# EAGLE design AIRDCL (EAGLE 9.5.1)
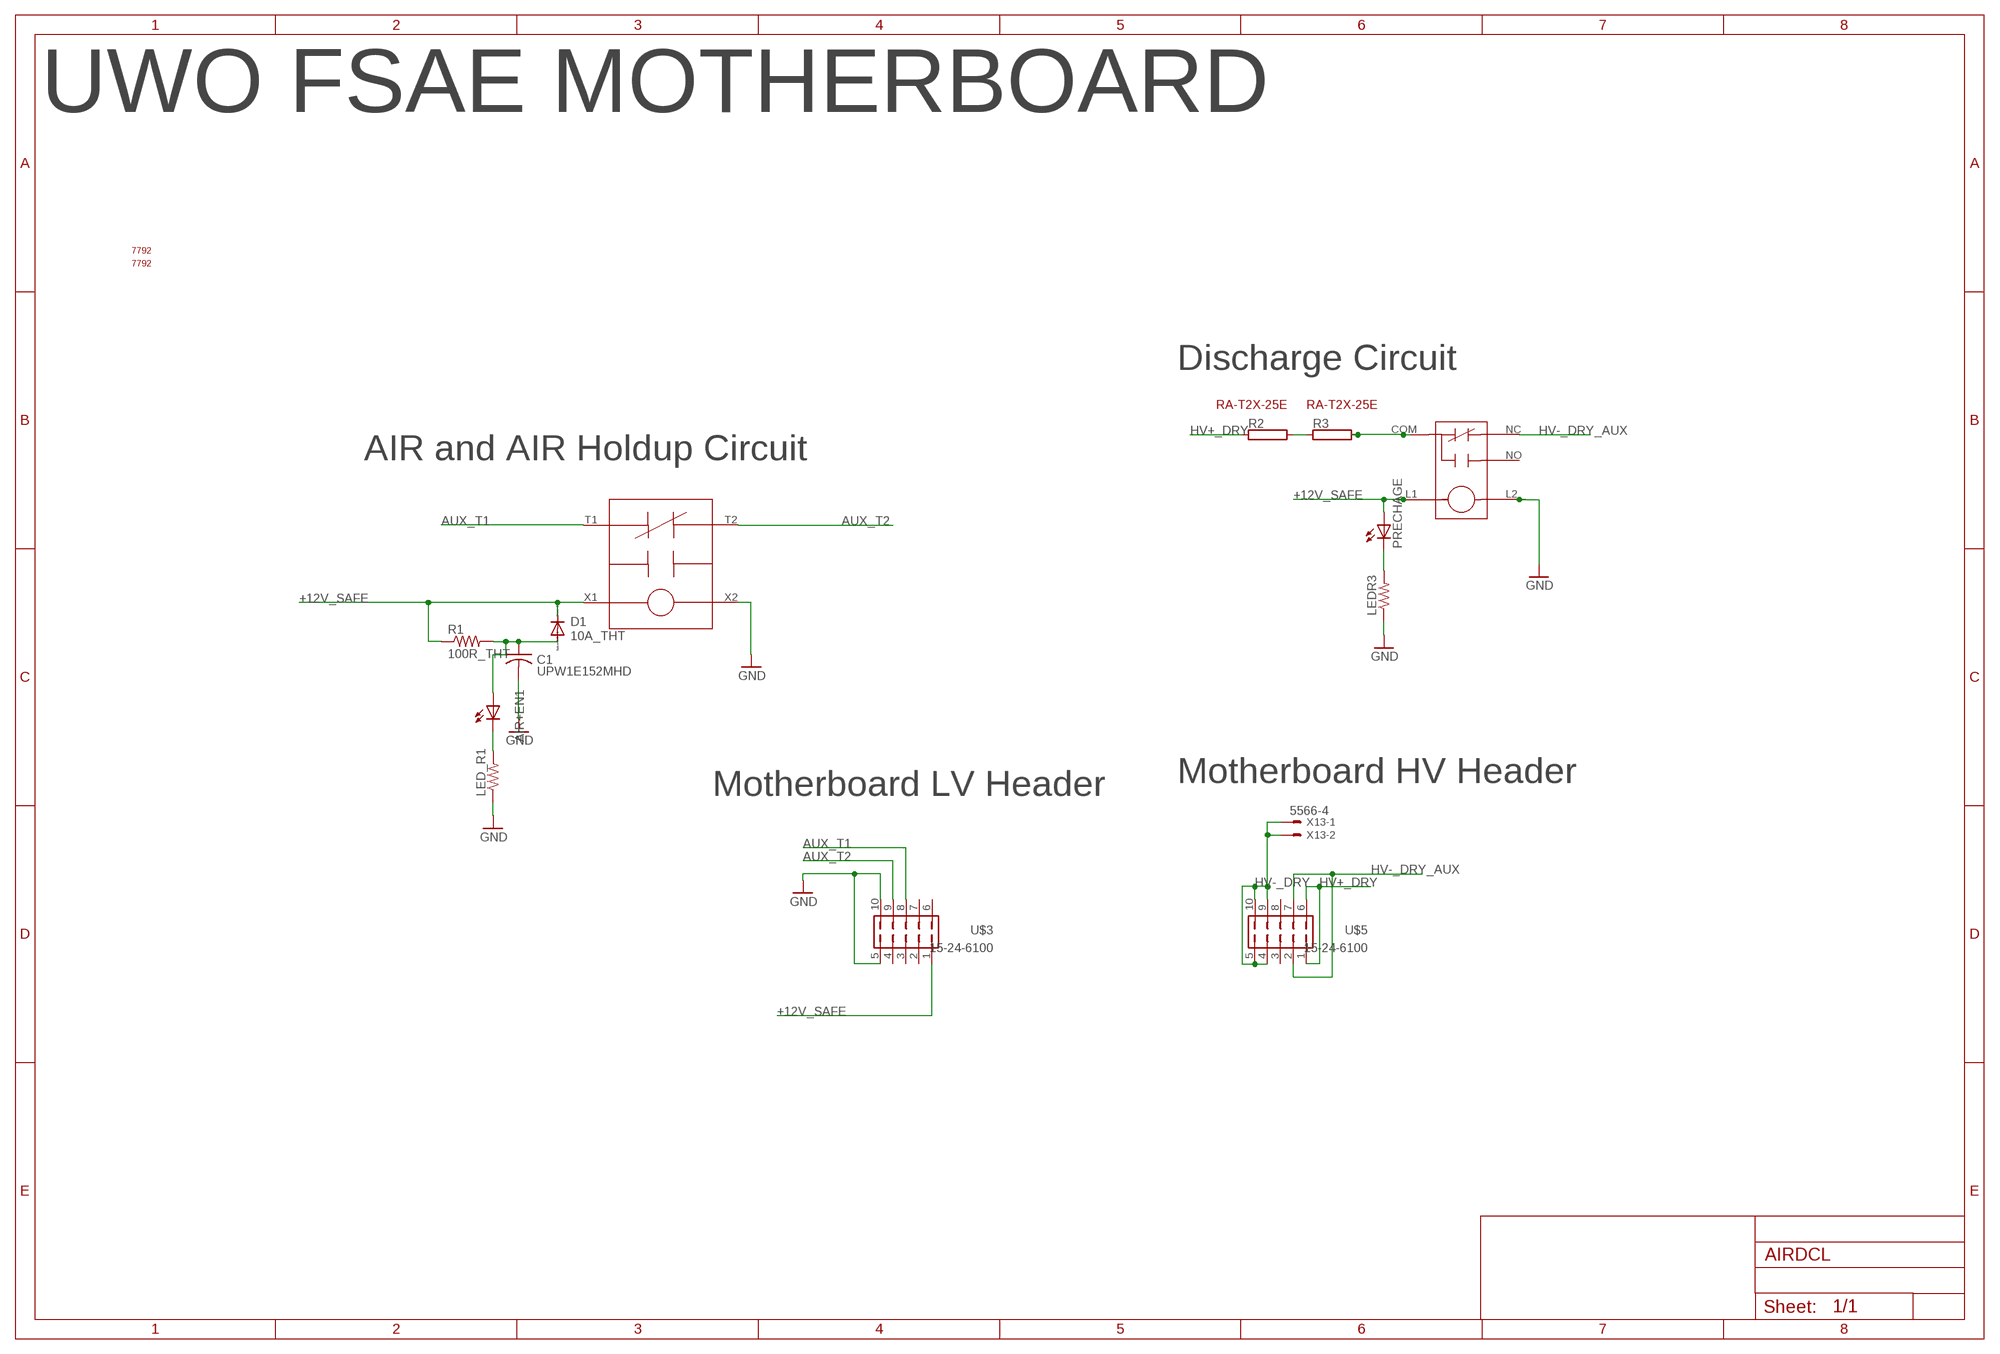
[diagram p0: schematic, sheet 1]

## Parts
AIR+EN1  LEDCHIPLED_0805  [CHIPLED_0805]
C1  UPW1E152MHD  AIR_HOLDUP_CAP  [CAPPRD750W65D1800H3700B]
D1  10A_THT  AIR_HOLDUP_DIODE  [DIOAD1570W120L850D500B]
LED_R1  R-US_R0805  [R0805]
LEDR3  R-US_R0805  [R0805]
PRECHAGE  LEDCHIPLED_0805  [CHIPLED_0805]
R1  100R_THT  AIR_HOLDUP_RESISTOR  [RESAD976W63L650D250B]
R2  RMG100-V  [TO-247-2V]
R3  RMG100-V  [TO-247-2V]
U$1  GV245BPB  GV224  [GV224]
U$2  7792  [7792]
U$3  15-24-6100  [15-24-6100]
U$4  G81C335  [G81C335]
U$5  15-24-6100  [15-24-6100]
U$6  7792  [7792]
U$8  RA-T2X-25E  [RA-T2X-25E]
U$9  RA-T2X-25E  [RA-T2X-25E]
X13  5566-4  [5566-4]

## Nets
+12V_SAFE: D1.1(C) PRECHAGE.A R1.1 U$1.X1 U$3.1 U$4.L1
AUX_T1: U$1.T1 U$3.8
AUX_T2: U$1.T2 U$3.9
GND: C1.2 LED_R1.1 LEDR3.1 U$1.X2 U$3.5 U$3.10 U$4.L2
HV+_DRY [HV]: R2.1 U$5.1 U$5.6
HV-_DRY [HV]: U$5.4 U$5.5 U$5.9 U$5.10 X13.1 X13.2
HV-_DRY_AUX [HV]: U$4.NC U$5.2 U$5.7
N$1: AIR+EN1.C LED_R1.2
N$2: LEDR3.2 PRECHAGE.C
N$3: AIR+EN1.A C1.1 D1.2(A) R1.2
N$4: R2.2 R3.1
N$21 [HV]: R3.2 U$4.COM
Unconnected: U$3.2 U$3.3 U$3.4 U$3.6 U$3.7 U$4.NO U$5.3 U$5.8 X13.3 X13.4

## Notes on the sheet
- UWO FSAE MOTHERBOARD
- Discharge Circuit
- AIR and AIR Holdup Circuit
- Motherboard HV Header
- Motherboard LV Header

## Library data of the parts
AIR+EN1 PRECHAGE = ACC-MB-R0:LED: LED OSRAM: - CHIPLED LG R971, LG N971, LY N971, LG Q971, LY Q971, LO R971, LY R971 LH N974, LH R974 LS Q976, LO Q976, LY Q976 LO Q996 - Hyper CHIPLED LW Q18S LB Q993, LB Q99A, LB R99A - SideLED LS A670, LO A670, LY A670, LG A670, LP A670 LB A673, LV A673, LT A673, LW A673 LH A674 LY A675 LS A676, LA A676, LO A676, LY A676, LW A676 LS A679, LY A679, LG A679 - Hyper Micro SIDELED® LS Y876, LA Y876, LO Y876, LY Y876 LT Y87S - SmartLED LW L88C, LW L88S LB L89C, LB L89S, LG L890 LS L89K, LO L89K, LY L89K LS L896, LA L896, LO L896, LY L896 - TOPLED LS T670, LO T670, LY T670, LG T670, LP T670 LSG T670, LSP T670, LSY T670, LOP T670, LYG T670 LG T671, LOG T671, LSG T671 LB T673, LV T673, LT T673, LW T673 LH T674 LS T676, LA T676, LO T676, LY T676, LB T676, LH T676, LSB T676, LW T676 LB T67C, LV T67C, LT T67C, LS T67K, LO T67K, LY T67K, LW E67C LS E67B, LA E67B, LO E67B, LY E67B, LB E67C, LV E67C, LT E67C LW T67C LS T679, LY T679, LG T679 LS T770, LO T770, LY T770, LG T770, LP T770 LB T773, LV T773, LT T773, LW T773 LH T774 LS E675, LA E675, LY E675, LS T675 LS T776, LA T776, LO T776, LY T776, LB T776 LHGB T686 LT T68C, LB T68C - Hyper Mini TOPLED® LB M676 - Mini TOPLED Santana® LG M470 LS M47K, LO M47K, LY M47K Source: http://www.osram.convergy.de LUXEON: - LUMILED® LXK2-PW12-R00, LXK2-PW12-S00, LXK2-PW14-U00, LXK2-PW14-V00 LXK2-PM12-R00, LXK2-PM12-S00, LXK2-PM14-U00 LXK2-PE12-Q00, LXK2-PE12-R00, LXK2-PE12-S00, LXK2-PE14-T00, LXK2-PE14-U00 LXK2-PB12-K00, LXK2-PB12-L00, LXK2-PB12-M00, LXK2-PB14-N00, LXK2-PB14-P00, LXK2-PB14-Q00 LXK2-PR12-L00, LXK2-PR12-M00, LXK2-PR14-Q00, LXK2-PR14-R00 LXK2-PD12-Q00, LXK2-PD12-R00, LXK2-PD12-S00 LXK2-PH12-R00, LXK2-PH12-S00 LXK2-PL12-P00, LXK2-PL12-Q00, LXK2-PL12-R00 Source: www.luxeon.com KINGBRIGHT: KA-3528ASYC Source: www.kingbright.com
C1 = Main:AIR_HOLDUP_CAP
D1 = Main:AIR_HOLDUP_DIODE
LED_R1 LEDR3 = ACC-MB-R0:R-US_: RESISTOR, American symbol; SPICEPREFIX: R
R1 = Main:AIR_HOLDUP_RESISTOR
R2 R3 = ACC-MB-R0:RMG100: TO-247 Power Resistor - RMG 100 Series Source: www.token.com.tw .. power-resistor-rmg100pdf; OC_FARNELL: unknown; OC_NEWARK: unknown
U$1 = ACC-MB-R0:GV224
U$2 U$6 = ACC-MB-R0:7792
U$3 U$5 = ACC-MB-R0:15-24-6100
U$4 = ACC-MB-R0:G81C335
U$8 U$9 = ACC-MB-R0:RA-T2X-25E
X13 = ACC-MB-R0:5566-4: Mini FIT connector 4 pol Source: http://www.molex.com; MF: MOLEX; OC_FARNELL: unknown; OC_NEWARK: unknown

## Net classes
0 default: width 0.2 mm, clearance 0.2 mm
2 HV: width 1.27 mm, clearance 1.5 mm to class 0, clearance 1.5 mm to class 1, clearance 1.5 mm

## Board
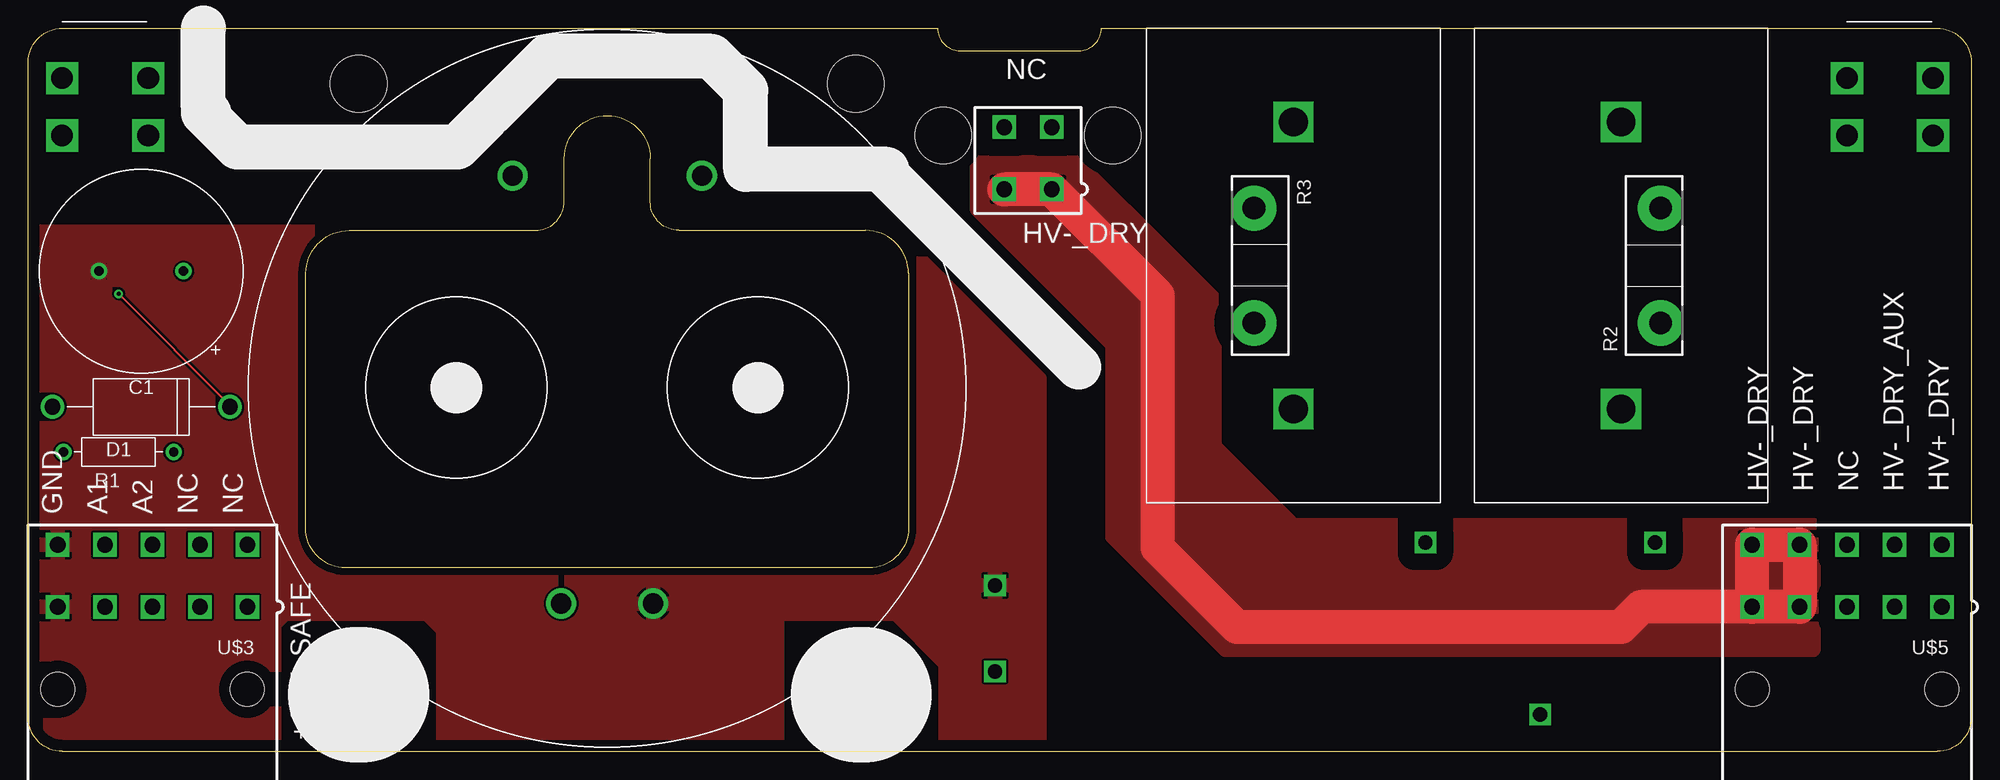
[diagram p1: board, top side]
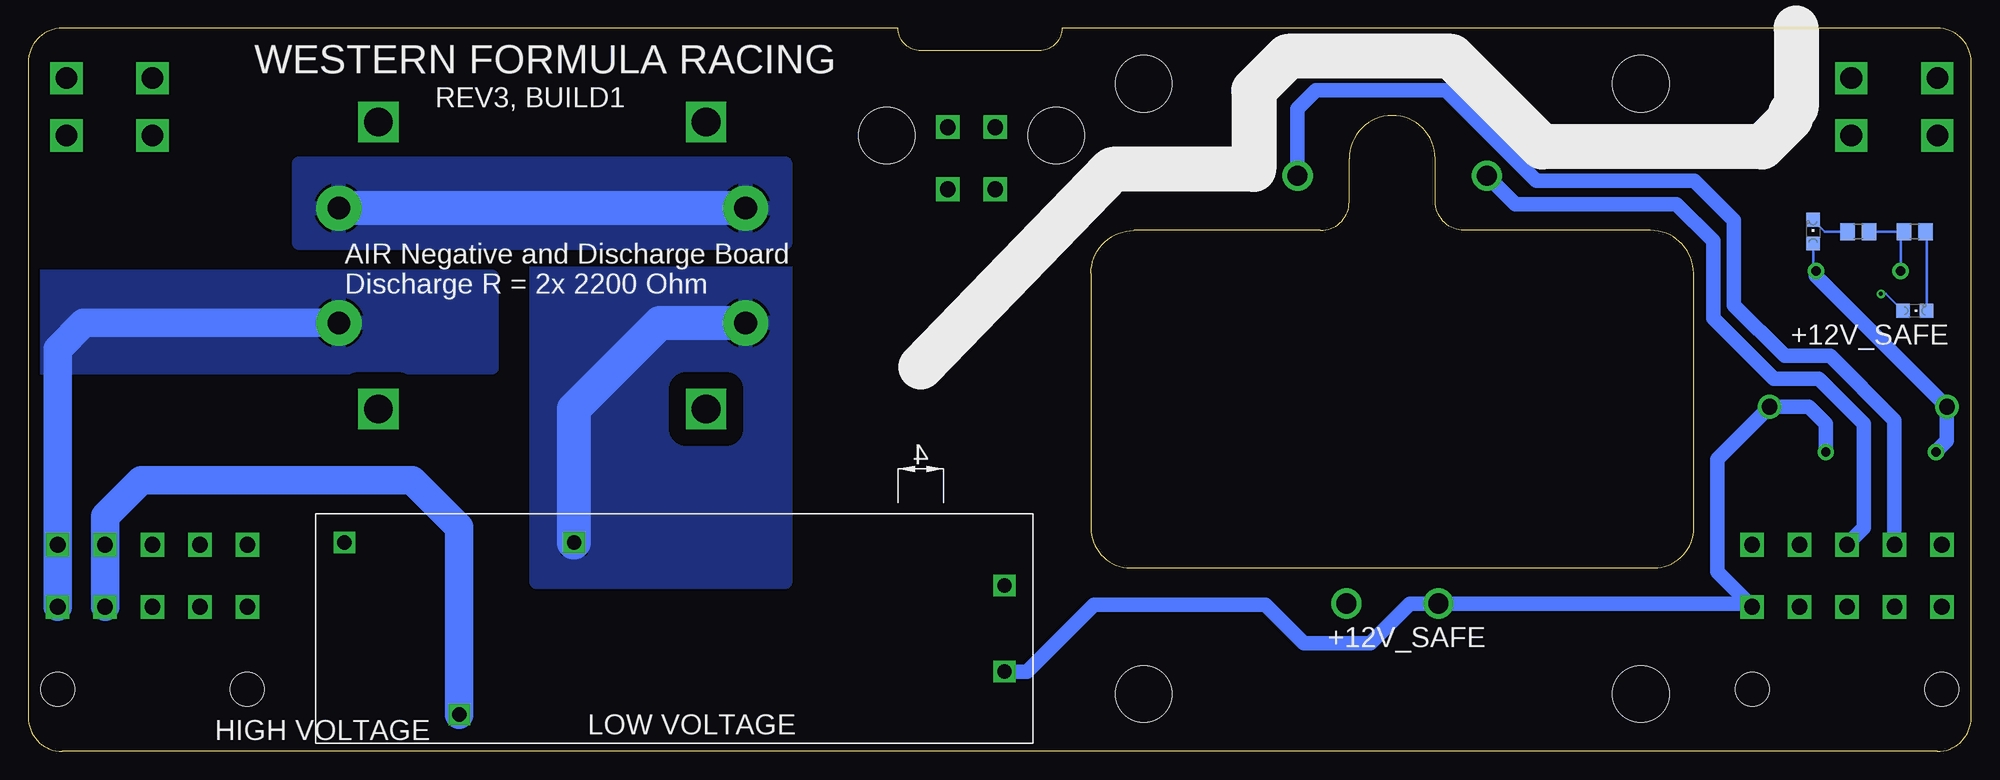
[diagram p2: board, bottom side, seen from below]

Size 172 x 64 mm. Coordinates in mm from the lower left corner, seen from the top.
Outline: 3,0 169,0 arc90 172,3 172,61 arc90 169,64 95,64 arc-90 93,62 82.5,62 arc-90 80.5,64 3,64 arc90 0,61 0,3 arc90 3,0
Copper layers (1*16): Top 0.035mm / dielectric 1.5mm / Bottom 0.035mm
Design rules "default": minimum track width 6mil, minimum drill 0.35mm, track to track 6mil, track to pad 6mil, pad to pad 6mil, via to via 6mil, smd to smd 6mil, copper to edge 40mil, drill to drill 6mil, minimum pad ring 10mil, minimum via ring 8mil, stop-mask expansion 4mil, vias tented up to drill 0mil, thermal gap 10mil
Holes 5 mm at 81,54.5 96,54.5
tRestrict: 11 lines

### Footprints (pad centres in the part's own frame; a part is rotated, then mirrored left to right if it is on the bottom)
CHIPLED_0805 = smd 1.2 x 1.2: A 0,-1.05; C 0,1.05
CAPPRD750W65D1800H3700B = drill 0.85 pad 1.45: 1 -3.75,0; 2 3.75,0
DIOAD1570W120L850D500B = drill 1.4 pad 2.1: 1 -7.85,0; 2 7.85,0
R0805 = smd 1.3 x 1.5: 1 -0.95,0; 2 0.95,0
RESAD976W63L650D250B = drill 0.83 pad 1.43: 1 -4.88,0; 2 4.88,0
TO-247-2V = drill 2 pad 4: 1 -5.08,0; 2 5.08,0
GV224 = drill 1.778: T1 -8.382,37.846; T2 8.382,37.846; X1 -4.064,0; X2 4.064,0 | hole 5: -22,46; 22,46; -22,-8; 22,-8
7792 = drill 1.905 square: P$1 0,5.08; P$2 7.62,5.08; P$3 7.62,0; P$4 0,0
15-24-6100 = drill 1.4 square: 1 8.4,-2.75; 2 4.2,-2.75; 3 0,-2.75; 4 -4.2,-2.75; 5 -8.4,-2.75; 6 8.4,2.75; 7 4.2,2.75; 8 0,2.75; 9 -4.2,2.75; 10 -8.4,2.75 | hole 3: 8.4,-10.05; -8.4,-10.05
G81C335 = drill 1.27 square: COM 20.32,0; L1 58.42,-11.43; L2 58.42,-3.81; NC 10.16,-15.24; NO 0,0
RA-T2X-25E = drill 2.54 square: P$1 -12.7,0; P$2 12.7,0
5566-4 = drill 1.4 square: 1 2.1,-2.75; 2 -2.1,-2.75; 3 2.1,2.75; 4 -2.1,2.75

### Placement (x,y rotation side)
AIR+EN1  14,46 0 bottom
C1  10,42.5 180 top
D1  10,30.5 180 top
LED_R1  10,46 180 bottom
LEDR3  5,46 0 bottom
PRECHAGE  5,39 270 bottom
R1  8,26.5 180 top
R2  144.5,43 90 top
R3  108.5,43 270 top
U$1  51.25,13.09 0 top
U$2  3,54.5 0 top
U$3  11,15.54 0 top
U$4  144,18.5 0 bottom
U$5  161,15.54 0 top
U$6  161,54.5 0 top
U$8  112,43 270 top
U$9  141,43 90 top
X13  88.5,52.5 0 top

### Tracks (layer width: path | path; a pad name or v marks a point on that pad's centre or on a via)
+12V_SAFE  (via drill 0.35)
  Top 0.2: v8,40.5 17.85,30.65 D1.1
  Bottom 0.2: PRECHAGE.A 7.55,40.5 v8,40.5
  Bottom 1.27: U$4.L1 83.58,7.07 77.65,13 62.5,13 59.07,9.57 53.21,9.57 49.69,13.09 U$1.X1 19.7,13.09 U$3.1 22.5,15.89 22.5,25.85 D1.1 14.38,30.5 12.88,29 R1.1
AUX_T1
  Bottom 1.27: U$1.T1 40.37,48.44 26.1,48.44 22.85,45.18 22.85,38.35 17.5,33 13.5,33 9.5,29 9.5,19.79 U$3.8
AUX_T2
  Bottom 1.27: U$1.T2 59.63,56.87 58,58.5 46.5,58.5 38.5,50.5 24.5,50.5 21,47 21,39.5 16.5,35 12.5,35 6.8,29.3 U$3.9
GND
  Bottom 0.2: C1.2 6.25,45.7 LEDR3.1 LED_R1.1
  pour Top: -5.5,46 -5.5,-7 89.5,-7 89.5,33 76.5,46
HV+_DRY
  Bottom 2.54: R2.1 167.08,37.92 169.4,35.6 U$5.6 U$5.1
  pour Bottom: 131,42 131,34 176,34 176,42
HV-_DRY
  Top 3: U$5.5 U$5.4 U$5.9 U$5.10 U$5.5 | U$5.5 142.79,12.79 141,11 107,11 100,18 100,40.35 X13.1 X13.2
  pour Top: 84,48 96,36 96,19 106,9 158,9 158,20 112,20 105,27 105,40 89,56 84,56
HV-_DRY_AUX
  Bottom 2.54: U$4.NC 133.84,19.84 138,24 162,24 165.2,20.8 U$5.7 U$5.2
N$1
  Bottom 0.2: LED_R1.2 12.95,46 AIR+EN1.C
N$2
  Bottom 0.2: PRECHAGE.C 3.95,45.9 LEDR3.2
N$3
  Bottom 0.2: AIR+EN1.A 14,42.35 13.75,42.1
  Bottom 1.27: R1.2 3.12,26.53 2.15,27.5 D1.2 13.75,42.1 C1.1
N$4
  Bottom 3: R3.1 R2.2
  pour Bottom: 105,51 105,45 148,45 148,52 105,52
N$21
  Bottom 3: U$4.COM 123.68,30.32 116.08,37.92 R3.2
  pour Bottom (rank 3): 105,43 105,15 127,15 127,43

### Text on the board
bPlace: WESTERN FORMULA RACING | +12V_SAFE | +12V_SAFE
tNames: NC | HV-_DRY | HV-_DRY | HV-_DRY | NC | HV-_DRY_AUX | HV+_DRY | GND | A1 | A2 | NC | NC | +12V_SAFE
bNames: REV3, BUILD1 | AIR Negative and Discharge Board / Discharge R = 2x 2200 Ohm | LOW VOLTAGE | HIGH VOLTAGE
tValues: BUILD 2